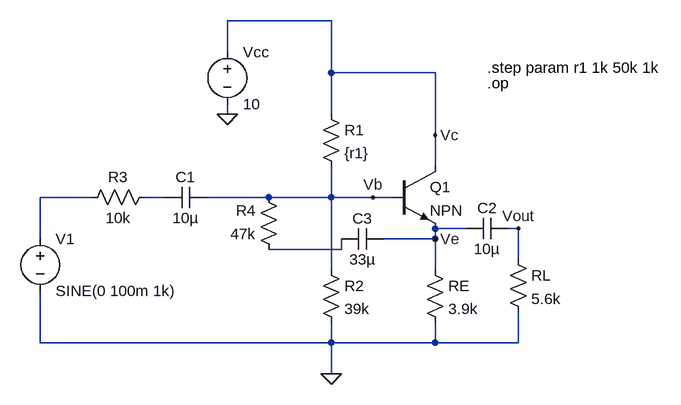
[diagram p0: schematic Bootstrap_Configuration_R1_Value.asc]
Bootstrap_Configuration_R1_Value.asc, the LTspice schematic file:
Version 4
SHEET 1 880 680
WIRE 48 -160 -112 -160
WIRE -112 -112 -112 -160
WIRE 48 -80 48 -160
WIRE 208 -80 48 -80
WIRE -112 -16 -112 -32
WIRE 48 -16 48 -80
WIRE 208 16 208 -80
WIRE 208 64 208 16
WIRE -320 112 -400 112
WIRE -208 112 -240 112
WIRE -48 112 -144 112
WIRE 48 112 48 64
WIRE 48 112 -48 112
WIRE 112 112 48 112
WIRE 144 112 112 112
WIRE 256 160 208 160
WIRE 336 160 320 160
WIRE -400 176 -400 112
WIRE 208 176 208 160
WIRE 208 176 128 176
WIRE 64 192 64 176
WIRE 64 192 -48 192
WIRE 336 208 336 160
WIRE 48 224 48 112
WIRE 208 224 208 176
WIRE -400 336 -400 256
WIRE 48 336 48 304
WIRE 48 336 -400 336
WIRE 208 336 208 304
WIRE 208 336 48 336
WIRE 336 336 336 288
WIRE 336 336 208 336
WIRE 48 384 48 336
FLAG -112 -16 0
FLAG 48 384 0
FLAG 336 160 Vout
FLAG 208 16 Vc
FLAG 208 176 Ve
FLAG 112 112 Vb
SYMBOL npn 144 64 R0
WINDOW 0 56 32 Left 2
WINDOW 3 56 68 Left 2
SYMATTR InstName Q1
SYMBOL res 32 -32 R0
WINDOW 0 36 40 Left 2
WINDOW 3 36 76 Left 2
SYMATTR InstName R1
SYMATTR Value {r1}
SYMBOL res 32 208 R0
WINDOW 0 36 40 Left 2
WINDOW 3 36 76 Left 2
SYMATTR InstName R2
SYMATTR Value 39k
SYMBOL res -224 96 R90
WINDOW 0 0 56 VBottom 2
WINDOW 3 32 56 VTop 2
SYMATTR InstName R3
SYMATTR Value 10k
SYMBOL res -32 208 R180
WINDOW 0 36 76 Left 2
WINDOW 3 36 40 Left 2
SYMATTR InstName R4
SYMATTR Value 47k
SYMBOL cap -144 96 R90
WINDOW 0 0 32 VBottom 2
WINDOW 3 32 32 VTop 2
SYMATTR InstName C1
SYMATTR Value 10µ
SYMBOL cap 320 144 R90
WINDOW 0 0 32 VBottom 2
WINDOW 3 32 32 VTop 2
SYMATTR InstName C2
SYMATTR Value 10µ
SYMBOL cap 128 160 R90
WINDOW 0 0 32 VBottom 2
WINDOW 3 32 32 VTop 2
SYMATTR InstName C3
SYMATTR Value 33µ
SYMBOL res 320 192 R0
WINDOW 0 36 40 Left 2
WINDOW 3 36 76 Left 2
SYMATTR InstName RL
SYMATTR Value 5.6k
SYMBOL res 192 208 R0
WINDOW 0 36 40 Left 2
WINDOW 3 36 76 Left 2
SYMATTR InstName RE
SYMATTR Value 3.9k
SYMBOL voltage -112 -128 R0
WINDOW 123 0 0 Left 0
WINDOW 39 0 0 Left 0
SYMATTR InstName Vcc
SYMATTR Value 10
SYMBOL voltage -400 160 R0
WINDOW 123 0 0 Left 0
WINDOW 39 0 0 Left 0
SYMATTR InstName V1
SYMATTR Value SINE(0 100m 1k)
TEXT 288 -88 Left 2 !.step param r1 1k 50k 1k
TEXT 288 -64 Left 2 !.op

The netlist it stands for:
* Bootstrap_Configuration_R1_Value.asc
Q1 Vc Vb Ve 0 NPN
R1 Vc Vb {r1}
R2 Vb 0 39k
R3 N002 N001 10k
R4 N003 Vb 47k
C1 Vb N002 10µ
C2 Vout Ve 10µ
C3 Ve N003 33µ
RL Vout 0 5.6k
RE Ve 0 3.9k
Vcc Vc 0 10
V1 N001 0 SINE(0 100m 1k)
.model NPN NPN
.model PNP PNP
.lib standard.bjt
.step param r1 1k 50k 1k
.op
.backanno
.end

* Results of the author's LTspice run, read from the files saved beside the schematic
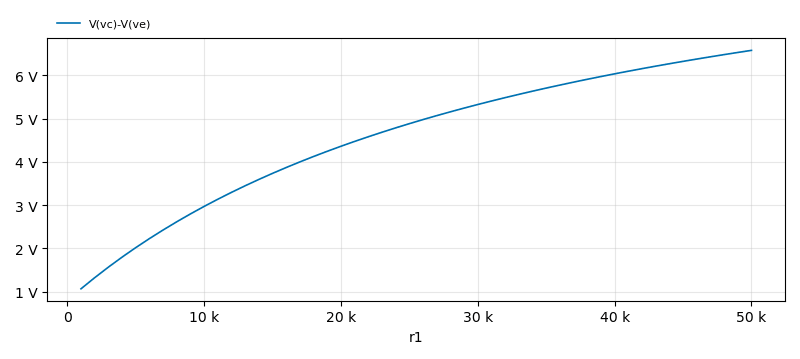
[diagram p1: Operating Point of Bootstrap_Configuration_R1_Value.asc, plotted from the saved traces]
* Operating Point, 1 run:
*   V(vc)-V(ve): 1.068 V at r1=1 k, 6.579 V at r1=50 k, min 1.068 V, max 6.579 V
* From the log:
*   Semiconductor Device Operating Points:
*                           --- Bipolar Transistors ---
*   Name:       q1
*   Model:      npn
*   Ib:       2.27e-05
*   Ic:       2.27e-03
*   Vbe:      7.95e-01
*   Vbc:     -2.72e-01
*   Vce:      1.07e+00
*   BetaDC:   1.00e+02
*   Gm:       8.77e-02
*   Rpi:      1.14e+03
*   Rx:       0.00e+00
*   Ro:       9.59e+18
*   Cbe:      0.00e+00
*   Cbc:      0.00e+00
*   Cjs:      0.00e+00
*   BetaAC:   1.00e+02
*   Cbx:      0.00e+00
*   Ft:       0.00e+00